# Altium schematic sheet Schemat.SchDoc
size 420 x 297 mm; SheetNumber: 1; SheetTotal: 1
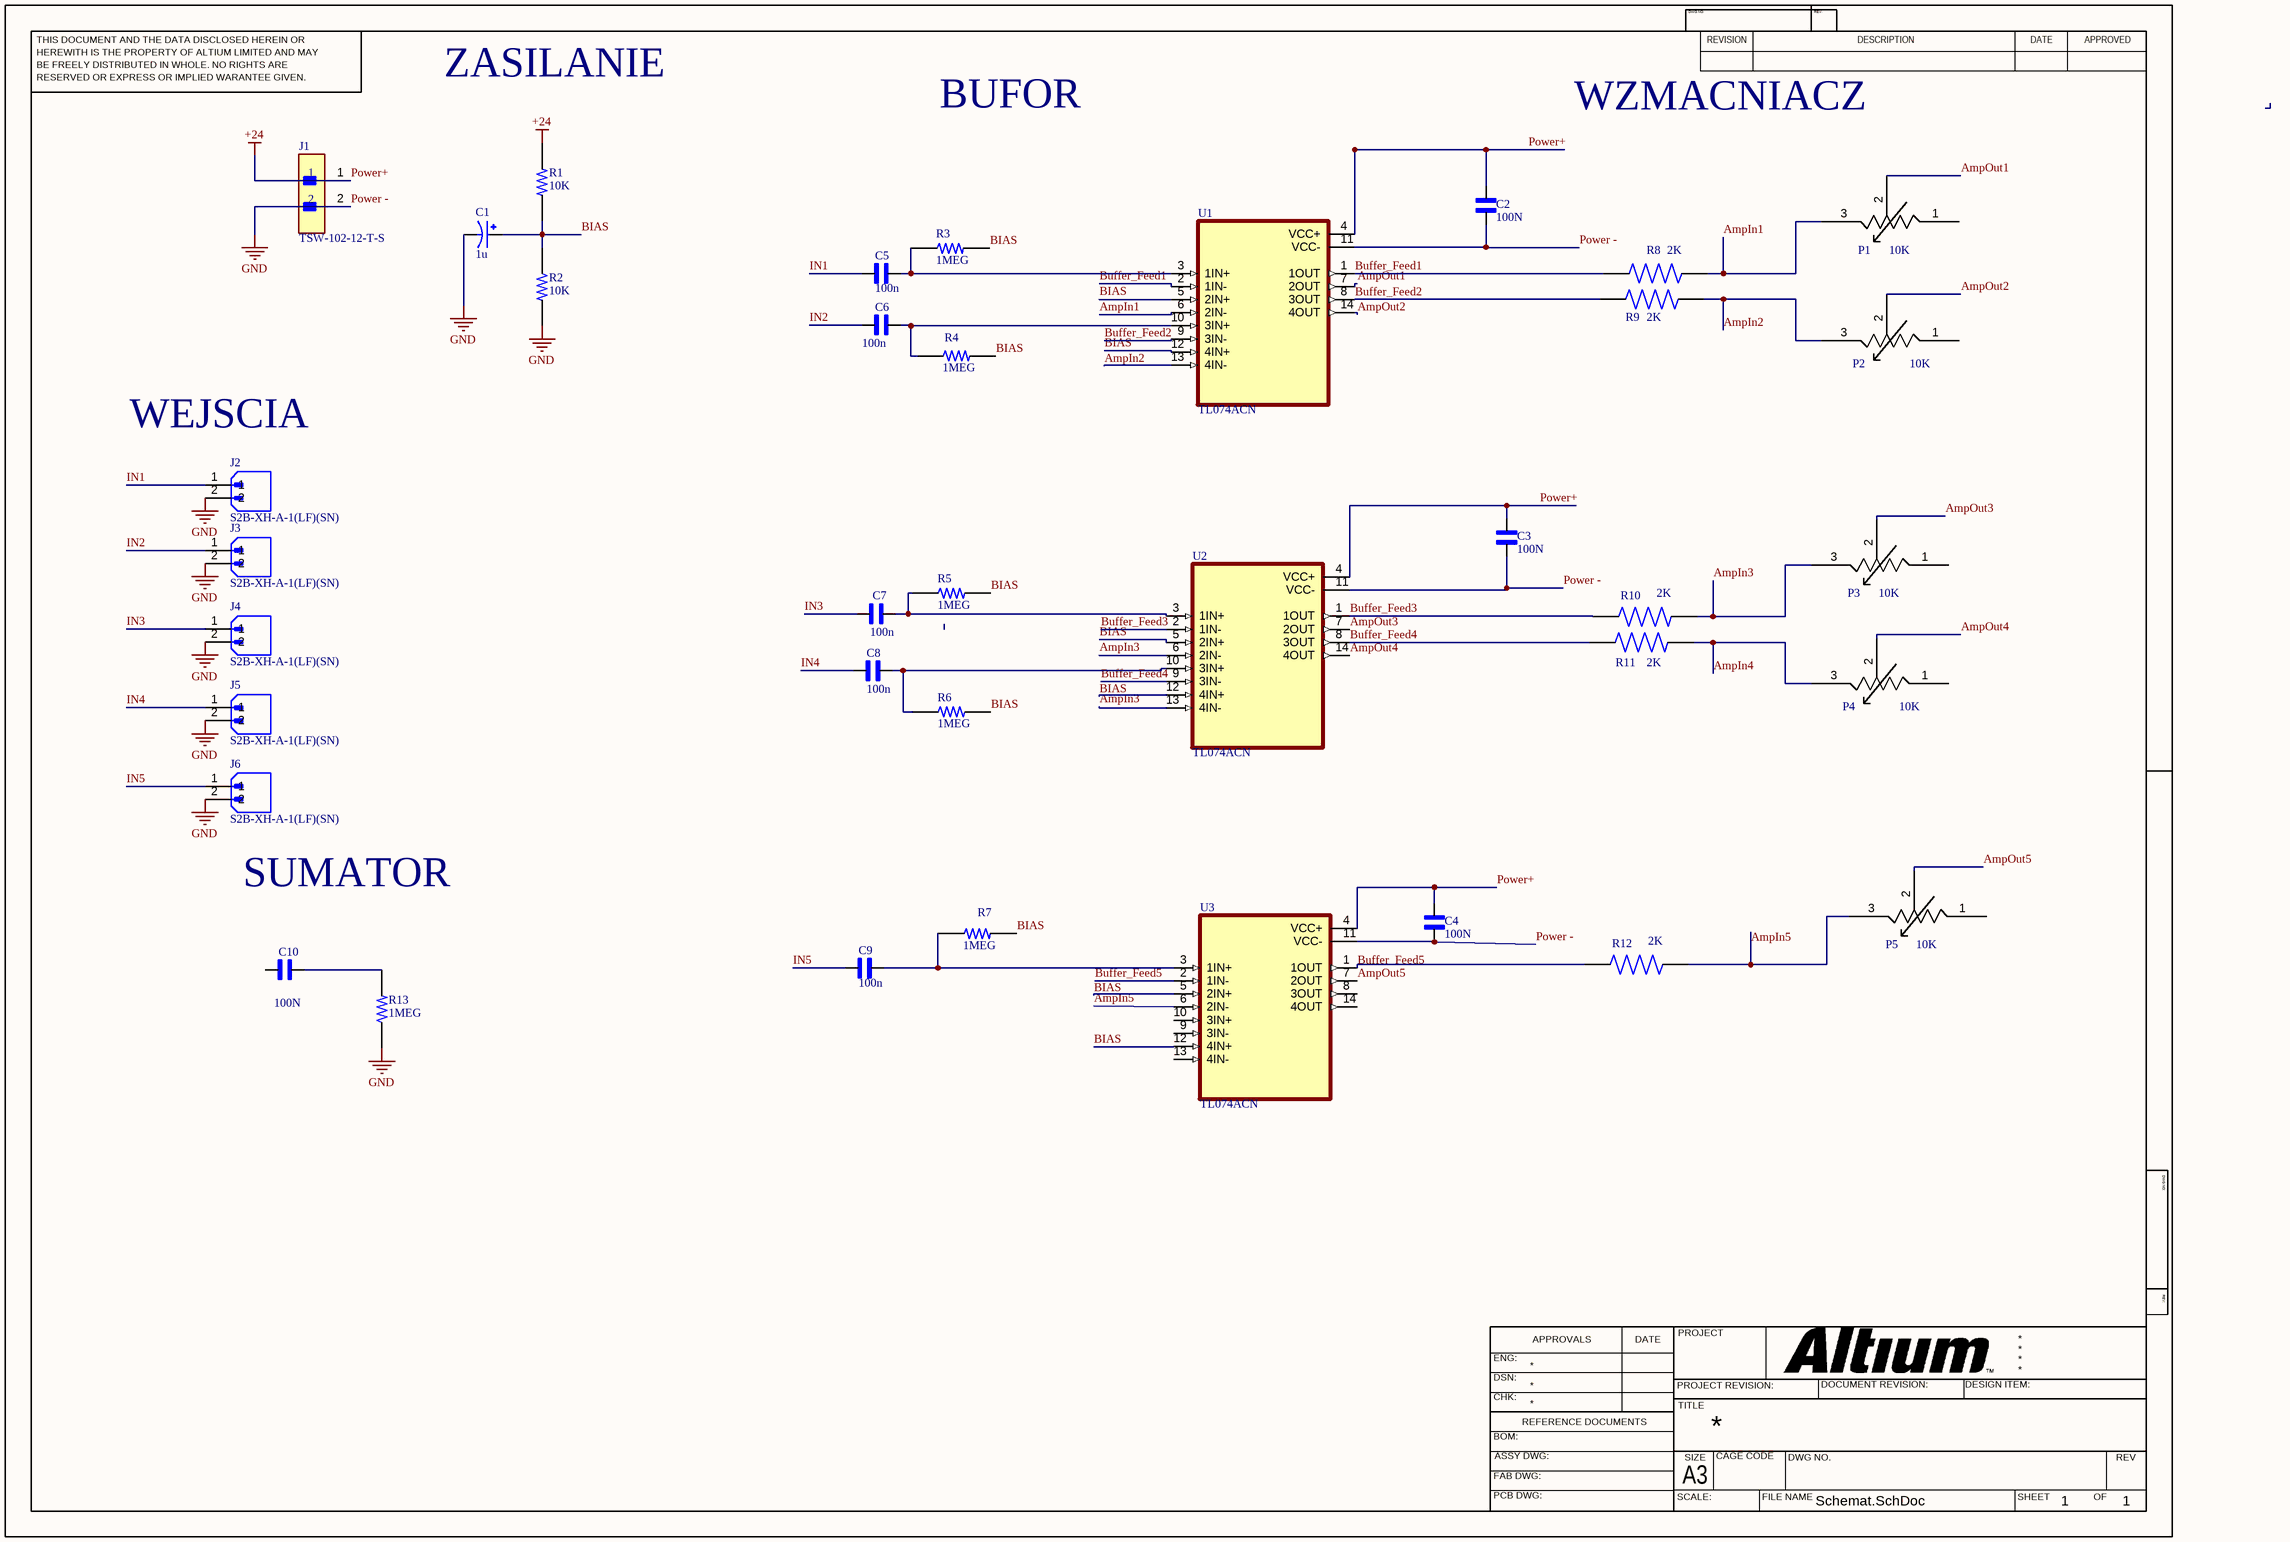
[diagram p0: Schemat.SchDoc]

## Parts
C1  1u  [CAPPRD500W60D1000H2000]
C2  100N  [CAPC4532X140N]
C3  100N  [CAPC4532X140N]
C4  100N  [CAPC4532X140N]
C5  100n  [CAPC4532X140N]
C6  100n  [CAPC4532X140N]
C7  100n  [CAPC4532X140N]
C8  100n  [CAPC4532X140N]
C9  100n  [CAPC4532X140N]
C10  100N  [CAPC4532X140N]
J1  TSW-102-12-T-S  [FP-TSW-102-12-T-S-MFG]
J2  S2B-XH-A-1(LF)(SN)  [JST_S2B-XH-A-1(LF)(SN)]
J3  S2B-XH-A-1(LF)(SN)  [JST_S2B-XH-A-1(LF)(SN)]
J4  S2B-XH-A-1(LF)(SN)  [JST_S2B-XH-A-1(LF)(SN)]
J5  S2B-XH-A-1(LF)(SN)  [JST_S2B-XH-A-1(LF)(SN)]
J6  S2B-XH-A-1(LF)(SN)  [JST_S2B-XH-A-1(LF)(SN)]
P1  10K  [16PMI-10K]
P2  10K  [16PMI-10K]
P3  10K  [16PMI-10K]
P4  10K  [16PMI-10K]
P5  10K  [16PMI-10K]
R1  10K  [RESC1608X55]
R2  10K  [RESC1608X55]
R3  1MEG  [RESC1608X60N]
R4  1MEG  [RESC1608X60N]
R5  1MEG  [RESC1608X60N]
R6  1MEG  [RESC1608X60N]
R7  1MEG  [RESC1608X60N]
R8  2K  [RES_ERJP06F2001V]
R9  2K  [RES_ERJP06F2001V]
R10  2K  [RES_ERJP06F2001V]
R11  2K  [RES_ERJP06F2001V]
R12  2K  [RES_ERJP06F2001V]
R13  1MEG  [RESC1608X60N]
U1  TL074ACN  [DIP794W45P254L1969H508Q14]
U2  TL074ACN  [DIP794W45P254L1969H508Q14]
U3  TL074ACN  [DIP794W45P254L1969H508Q14]

## Nets
Power -: C1.N C2.1 C3.1 C4.1 J1.2 J2.2 J3.2 J4.2 J5.2 J6.2 R2.2 R13.1 U1.11(VCC-) U2.11(VCC-) U3.11(VCC-)  [also labelled GND]
Power+: C2.2 C3.2 C4.2 J1.1 R1.1 U1.4(VCC+) U2.4(VCC+) U3.4(VCC+)  [also labelled +24]
AmpIn1: P1.3 R8.2 U1.6(2IN-)
AmpIn2: P2.3 R9.2 U1.13(4IN-)
AmpIn3: P3.3 R10.2 U2.6(2IN-) U2.13(4IN-)
AmpIn4: P4.3 R11.2
AmpIn5: P5.3 R12.2 U3.6(2IN-)
AmpOut1: P1.2 U1.7(2OUT)
AmpOut2: P2.2 U1.14(4OUT)
AmpOut3: P3.2 U2.7(2OUT)
AmpOut4: P4.2 U2.14(4OUT)
AmpOut5: P5.2 U3.7(2OUT)
BIAS: C1.P R1.2 R2.1 R3.2 R4.2 R5.2 R6.2 R7.2 U1.5(2IN+) U1.12(4IN+) U2.5(2IN+) U2.12(4IN+) U3.5(2IN+) U3.12(4IN+)
Buffer_Feed1: R8.1 U1.1(1OUT) U1.2(1IN-)
Buffer_Feed2: R9.1 U1.8(3OUT) U1.9(3IN-)
Buffer_Feed3: R10.1 U2.1(1OUT) U2.2(1IN-)
Buffer_Feed4: R11.1 U2.8(3OUT) U2.9(3IN-)
Buffer_Feed5: R12.1 U3.1(1OUT) U3.2(1IN-)
IN1: C5.1 J2.1
IN2: C6.1 J3.1
IN3: C7.1 J4.1
IN4: C8.1 J5.1
IN5: C9.1 J6.1
NetC5_2: C5.2 R3.1 U1.3(1IN+)
NetC6_2: C6.2 R4.1 U1.10(3IN+)
NetC7_2: C7.2 R5.1 U2.3(1IN+)
NetC8_2: C8.2 R6.1 U2.10(3IN+)
NetC9_2: C9.2 R7.1 U3.3(1IN+)
NetC10_1: C10.1 R13.2

Not connected (* = marked no-connect by the designer): C10 2; P1 1; P2 1; P3 1; P4 1; P5 1; U3 8(3OUT) 9(3IN-) 10(3IN+) 13(4IN-) 14(4OUT)

## Notes on the sheet
- ZASILANIE
- BUFOR
- WZMACNIACZ
- (near J2) WEJSCIA
- SUMATOR
- THIS DOCUMENT AND THE DATA DISCLOSED HEREIN OR
- HEREWITH IS THE PROPERTY OF ALTIUM LIMITED AND MAY
- DWG NO:
- REVISION
- REV:
- DESCRIPTION
- DATE
- APPROVED
- BE FREELY DISTRIBUTED IN WHOLE. NO RIGHTS ARE
- RESERVED OR EXPRESS OR IMPLIED WARANTEE GIVEN.
- ENG:
- APPROVALS
- PROJECT
- DSN:
- CHK:
- REFERENCE DOCUMENTS
- PROJECT REVISION:
- TITLE
- DOCUMENT REVISION:
- DESIGN ITEM:
- BOM:
- FAB DWG:
- PCB DWG:
- ASSY DWG:
- SCALE:
- A3
- SIZE
- CAGE CODE
- FILE NAME
- DWG NO.
- SHEET
- OF
- REV

## Library data of the parts
C1 = ECA2GHG100: 10ÂµF 400V Aluminum Electrolytic Capacitors Radial, Can 2000 Hrs @ 105Â°C; MF: Panasonic; Value: *; Check_prices: https://www.snapeda.com/parts/ECA2GHG100/Panasonic/view-part/?ref=eda; Price: None; MP: ECA2GHG100; SnapEDA_Link: https://www.snapeda.com/parts/ECA2GHG100/Panasonic/view-part/?ref=snap; Availability: Not in stock; Package: RADIAL-2 Panasonic
C2-C10 = C1812C104J1GACAUTO: 0.1 ÂµF Â±5% 100V Ceramic Capacitor C0G, NP0 1812 (4532 Metric); MF: KEMET; SnapEDA_Link: https://www.snapeda.com/parts/C1812C104J1GACAUTO/Kemet/view-part/?ref=snap; Package: 4532 KEMET; Value: *; MP: C1812C104J1GACAUTO; Check_prices: https://www.snapeda.com/parts/C1812C104J1GACAUTO/Kemet/view-part/?ref=eda
J1 = CMP-02766-001444-1: CONN HEADER VERT 2POS 2.54MM; Gender: Male; Number of Contacts: 2; RoHS Compliant: Yes; Mount: Through Hole; Termination: Solder; Packaging: Bulk; Contact Material: Bronze; Contact Plating: Tin; Number of Rows: 1; REACH SVHC: No SVHC; Pitch: 2.54mm; Radiation Hardening: No
J2-J6 = S2B-XH-A-1(LF)(SN): Connector Header Through Hole, Right Angle 2 position 0.098 (2.50mm); MF: JST Sales; SnapEDA_Link: https://www.snapeda.com/parts/S2B-XH-A-1(LF)(SN)/JST+Sales+America+Inc./view-part/?ref=snap; Package: None; Value: *; MP: S2B-XH-A-1(LF)(SN); Check_prices: https://www.snapeda.com/parts/S2B-XH-A-1(LF)(SN)/JST+Sales+America+Inc./view-part/?ref=eda
P1-P5 = 16PMI-10K
R1 R2 = WR06X1002FTL: MF: {'manufacturer': u'Walsin Technology Corporation'}; Package: None; Price: None; Value: *; MP: WR06X1002FTL; Availability: Unavailable
R3-R7 R13 = WR06X1004FTL: RES, 1M, 1%, 75V, 0603, THICK FILM; Resistor Case Style:0603 [1608 Metric]; Resistance:1Mohm; Product Range:WR06 Series; Voltage Rating:75V; Resistor Element Material:Thick Film; Power Rating:100mW; Resistance Tolerance:Â± 1%; Temperature Coefficient:Â± 100ppm/Â°C; Automotive Qualification Standard:-; SVHC:Lead (15-Jan-2019); MF: Walsin Technology Corp; SnapEDA_Link: https://www.snapeda.com/parts/WR06X1004FTL/Techno/view-part/?ref=snap; Package: SMD-2 WALSIN; Value: *; MP: WR06X1004FTL; Check_prices: https://www.snapeda.com/parts/WR06X1004FTL/Techno/view-part/?ref=eda
R8-R12 = ERJP06F2001V: Value: *; Package: None; Availability: Unavailable; MP: ERJP06F2001V; Price: None
U1-U3 = TL074ACN: Quad, 30-V, 3-MHz, high slew rate (13-V/Âµs), 6-mV offset voltage, In to V+, JFET-input op amp; MF: Texas Instruments; SnapEDA_Link: https://www.snapeda.com/parts/TL074ACN/Texas+Instruments/view-part/?ref=snap; Package: PDIP-14 Texas Instruments; Value: *; MP: TL074ACN; Check_prices: https://www.snapeda.com/parts/TL074ACN/Texas+Instruments/view-part/?ref=eda